# EAGLE design carte (EAGLE 7.2.0)
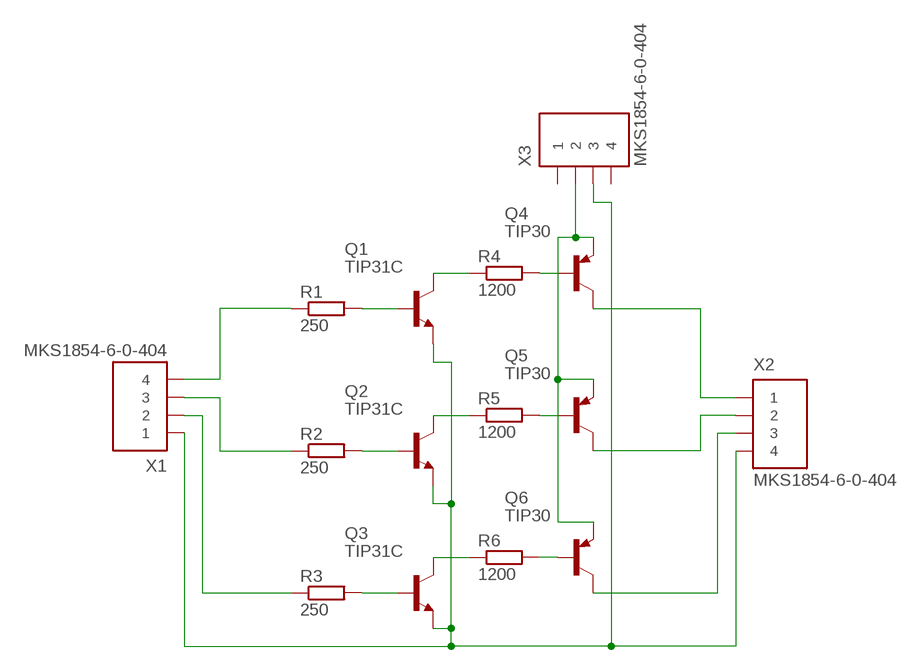
[diagram p0: schematic, sheet 1]

## Parts
Q1  TIP31C  [TO220]
Q2  TIP31C  [TO220]
Q3  TIP31C  [TO220]
Q4  TIP30  [TO220]
Q5  TIP30  [TO220]
Q6  TIP30  [TO220]
R1  250  R-EU_0207/10  [0207/10]
R2  250  R-EU_0207/10  [0207/10]
R3  250  R-EU_0207/10  [0207/10]
R4  1200  R-EU_0207/10  [0207/10]
R5  1200  R-EU_0207/10  [0207/10]
R6  1200  R-EU_0207/10  [0207/10]
X1  MKS1854-6-0-404  [MKS1854-6-0-404]
X2  MKS1854-6-0-404  [MKS1854-6-0-404]
X3  MKS1854-6-0-404  [MKS1854-6-0-404]

## Nets
N$1: Q1.1(B) R1.2
N$2: Q2.1(B) R2.2
N$3: Q3.1(B) R3.2
N$4: Q1.2(C) R4.1
N$5: Q2.2(C) R5.1
N$6: Q3.2(C) R6.1
N$7: Q4.1(B) R4.2
N$8: Q5.1(B) R5.2
N$9: Q6.1(B) R6.2
N$10: Q1.3(E) Q2.3(E) Q3.3(E) X1.1 X2.4 X3.3
N$12: R1.1 X1.4
N$13: R2.1 X1.3
N$14: R3.1 X1.2
N$15: Q4.3(E) Q5.3(E) Q6.3(E) X3.2
N$16: Q4.2(C) X2.1
N$17: Q5.2(C) X2.2
N$18: Q6.2(C) X2.3
Unconnected: X3.1 X3.4

## Library data of the parts
Q1-Q3 = transistor-npn:TIP31C*: NPN Transistor
Q4-Q6 = transistor-pnp:TIP30: PNP Transistor
R1-R6 = resistor:R-EU_: RESISTOR, European symbol
X1-X3 = con-stocko:MKS1854-6-0-404: Serie MKS 1850 Lötstifte In-line, Raster 2.5 mm, Stiftwannen, stehend, mit Rastlasche Source: http://www.stocko.de/de/index.php?seite=ka_rfk2_mks1850.html&rubrik=Katalog+-+RFK+2 rfk_1850.pdf; OC_FARNELL: 1141862; OC_NEWARK: unknown

## Net classes
0 default: width 1 mm

## Board
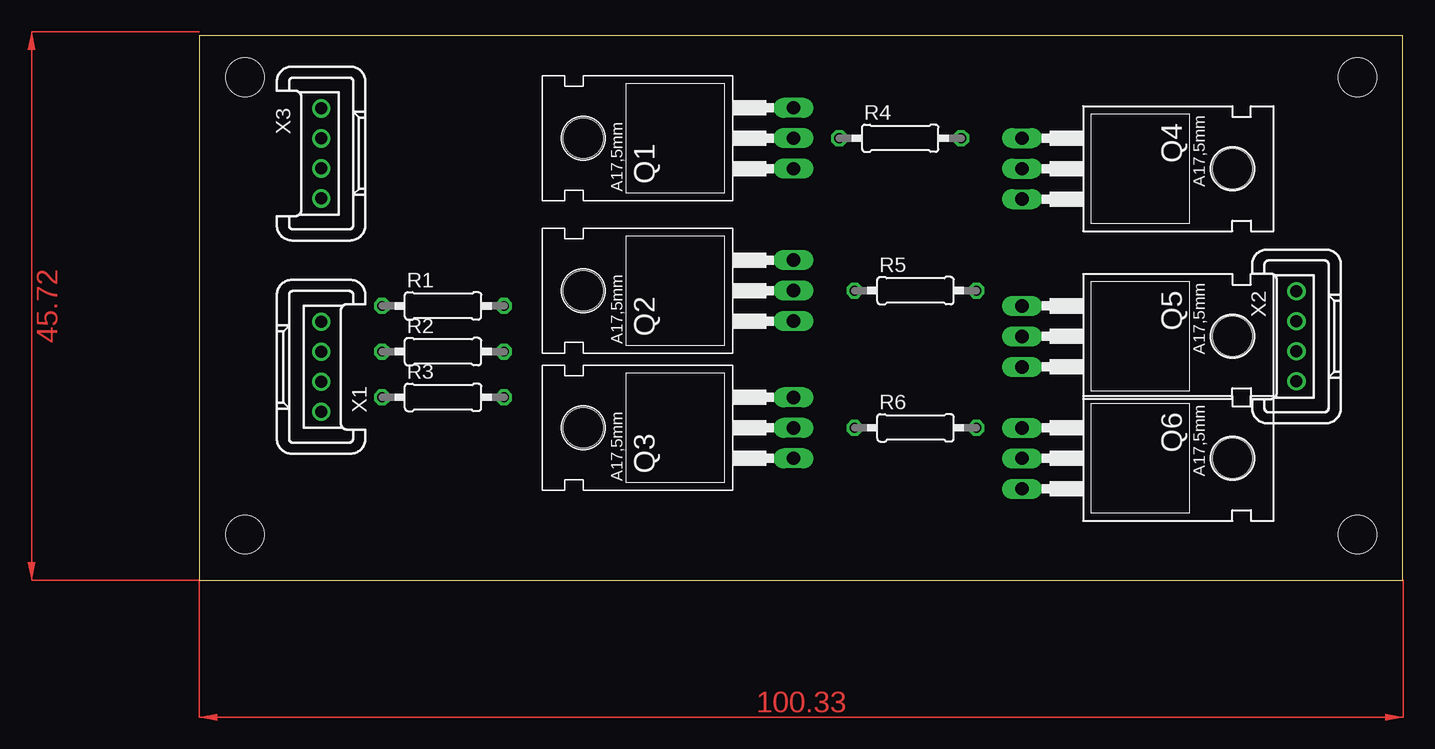
[diagram p1: board, top side]
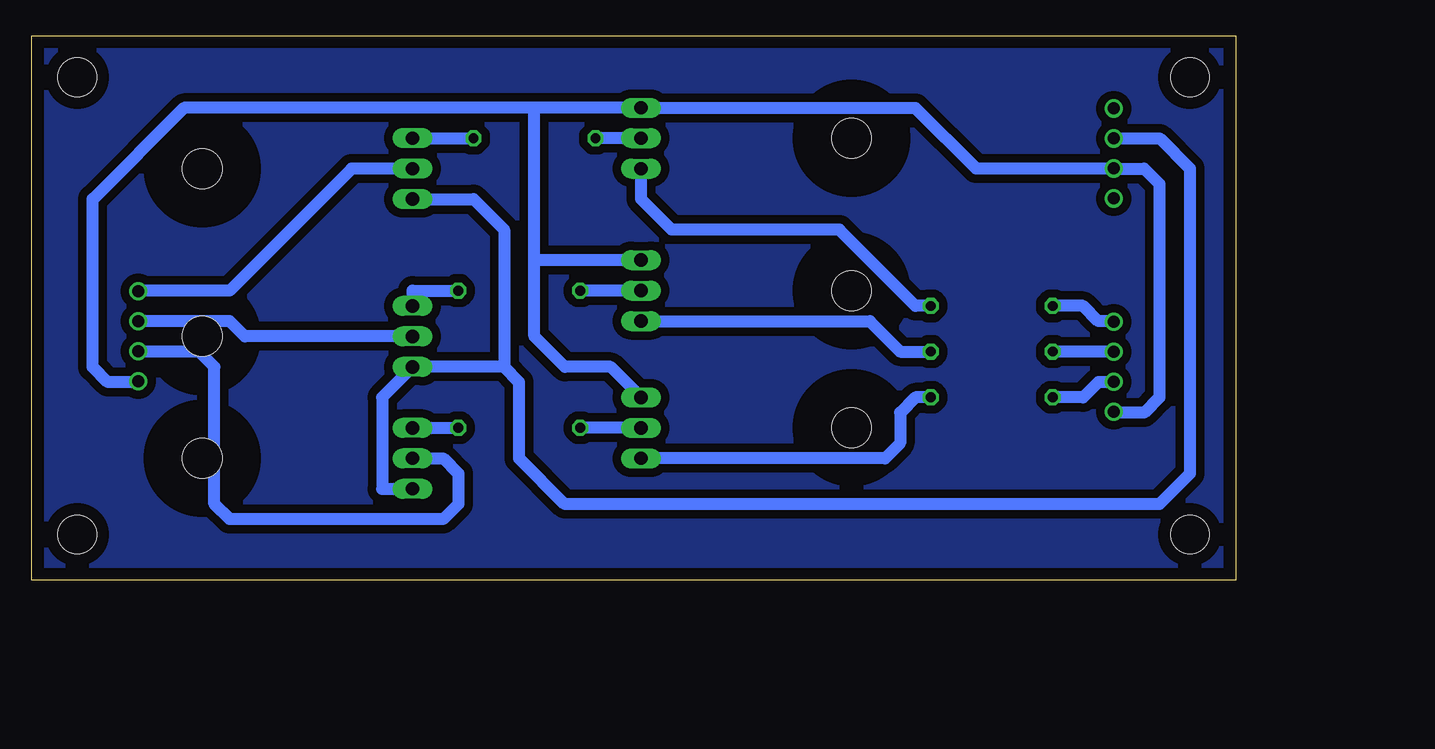
[diagram p2: board, bottom side, seen from below]

Size 100.31 x 45.39 mm. Coordinates in mm from the lower left corner, seen from the top.
Outline: 0,0 100.31,0 100.31,45.39 0,45.39 0,0
Copper layers (1*16): Top 0.035mm / dielectric 1.5mm / Bottom 0.035mm
Design rules "default": minimum track width 10mil, minimum drill 24mil, track to track 8mil, track to pad 8mil, pad to pad 8mil, via to via 8mil, smd to smd 8mil, copper to edge 40mil, drill to drill 8mil, minimum pad ring 10mil, minimum via ring 8mil, stop-mask expansion 4mil, vias tented up to drill 0mil, thermal gap 10mil
Holes 3.2 mm at 3.81,41.91 3.81,3.81 96.52,3.81 96.52,41.91

### Footprints (pad centres in the part's own frame; a part is rotated, then mirrored left to right if it is on the bottom)
TO220 = drill 1.118 long: 1 -2.54,-6.35; 2 0,-6.35; 3 2.54,-6.35 | hole 3.302: 0,11.176
0207/10 = drill 0.813 octagon: 1 -5.08,0; 2 5.08,0
MKS1854-6-0-404 = drill 1 pad 1.422: 1 -3.75,0; 2 -1.25,0; 3 1.25,0; 4 3.75,0

### Placement (x,y rotation side)
Q1  43.18,36.83 90 top
Q2  43.18,24.13 90 top
Q3  43.18,12.7 90 top
Q4  74.93,34.29 270 top
Q5  74.93,20.32 270 top
Q6  74.93,10.16 270 top
R1  20.32,22.86 0 top
R2  20.32,19.05 0 top
R3  20.32,15.24 0 top
R4  58.42,36.83 0 top
R5  59.69,24.13 0 top
R6  59.69,12.7 0 top
X1  10.16,17.78 90 top
X2  91.44,20.32 270 top
X3  10.16,35.56 270 top

### Tracks (layer width: path | path; a pad name or v marks a point on that pad's centre or on a via)
N$1
  Bottom 1: R1.2 26.67,22.86 33.02,29.21 46.99,29.21 49.53,31.75 Q1.1
N$2
  Bottom 1: Q2.1 30.48,21.59 27.94,19.05 R2.2
N$3
  Bottom 1: R3.2 26.67,15.24 27.94,13.97 27.94,11.43 29.21,10.16 Q3.1
N$4
  Bottom 1: Q1.2 R4.1
N$5
  Bottom 1: Q2.2 R5.1
N$6
  Bottom 1: Q3.2 R6.1
N$7
  Bottom 1: Q4.1 R4.2
N$8
  Bottom 1: R5.2 68.58,24.13 Q5.1
N$9
  Bottom 1: Q6.1 R6.2
N$10
  Bottom 1: X1.1 10.16,13.97 7.62,13.97 6.35,15.24 6.35,33.02 7.62,34.29 10.16,34.29 X3.3 21.61,34.31 26.67,39.37 Q1.3 58.42,39.37 | 58.42,39.37 87.63,39.37 95.25,31.75 95.25,17.78 93.98,16.51 91.44,16.51 X2.4 | Q3.3 52.07,17.78 55.88,17.78 58.42,20.32 58.42,26.67 | Q2.3 58.42,26.67 | 58.42,26.67 58.42,39.37
N$12
  Bottom 1: X1.4 10.22,21.59 11.43,21.59 12.7,22.86 R1.1
N$13
  Bottom 1: R2.1 10.16,19.05 X1.3
N$14
  Bottom 1: X1.2 10.18,16.51 11.43,16.51 12.7,15.24 R3.1
N$15
  Bottom 1: Q6.3 71.12,7.62 71.12,15.24 Q5.3 60.96,17.78 | X3.2 6.33,36.81 3.81,34.29 3.81,8.89 6.35,6.35 55.88,6.35 59.69,10.16 59.69,16.51 60.96,17.78 | Q4.3 63.5,31.75 60.96,29.21 60.96,17.78
N$16
  Bottom 1: Q4.2 73.66,34.29 83.82,24.13 91.44,24.13 X2.1
N$17
  Bottom 1: 91.44,21.59 X2.2 91.42,21.59 83.82,21.59 82.55,20.32 Q5.2
N$18
  Bottom 1: Q6.2 66.04,10.16 64.77,8.89 64.77,6.35 66.04,5.08 83.82,5.08 85.09,6.35 85.09,17.78 86.36,19.05 91.42,19.05 X2.3
N$27
  pour Bottom (isolate 0.7): 0,45.72 100.33,45.72 100.33,0 0,0
N$28
  Bottom 0.8: 2.54,3.81 3.81,3.81 | 5.08,3.81 3.81,3.81 | 3.81,3.81 3.81,5.08 | 3.81,3.81 3.81,2.54
N$29
  Bottom 0.8: 2.54,41.91 3.81,41.91 | 5.08,41.91 3.81,41.91 | 3.81,41.91 3.81,43.18 | 3.81,41.91 3.81,40.64
N$30
  Bottom 0.8: 95.25,41.91 96.52,41.91 | 97.79,41.91 96.52,41.91 | 96.52,41.91 96.52,43.18 | 96.52,41.91 96.52,40.64
N$31
  Bottom 0.8: 95.25,3.81 96.52,3.81 | 97.79,3.81 96.52,3.81 | 96.52,3.81 96.52,5.08 | 96.52,3.81 96.52,2.54
(copper drawn outside any net)
  shapes: Top area x2